# EasyEDA Pro project New Project ufcd 6024.eprj

# Schematic Schematic1
Board Name: Board1; Create Date: 2025-01-02; Page Name: P1; Project Name: New Project ufcd 6024; Schematic Name: Schematic1; Update Date: 2025-01-02; Company: EasyEDA.com; Page Size: A4; Version: V1.0
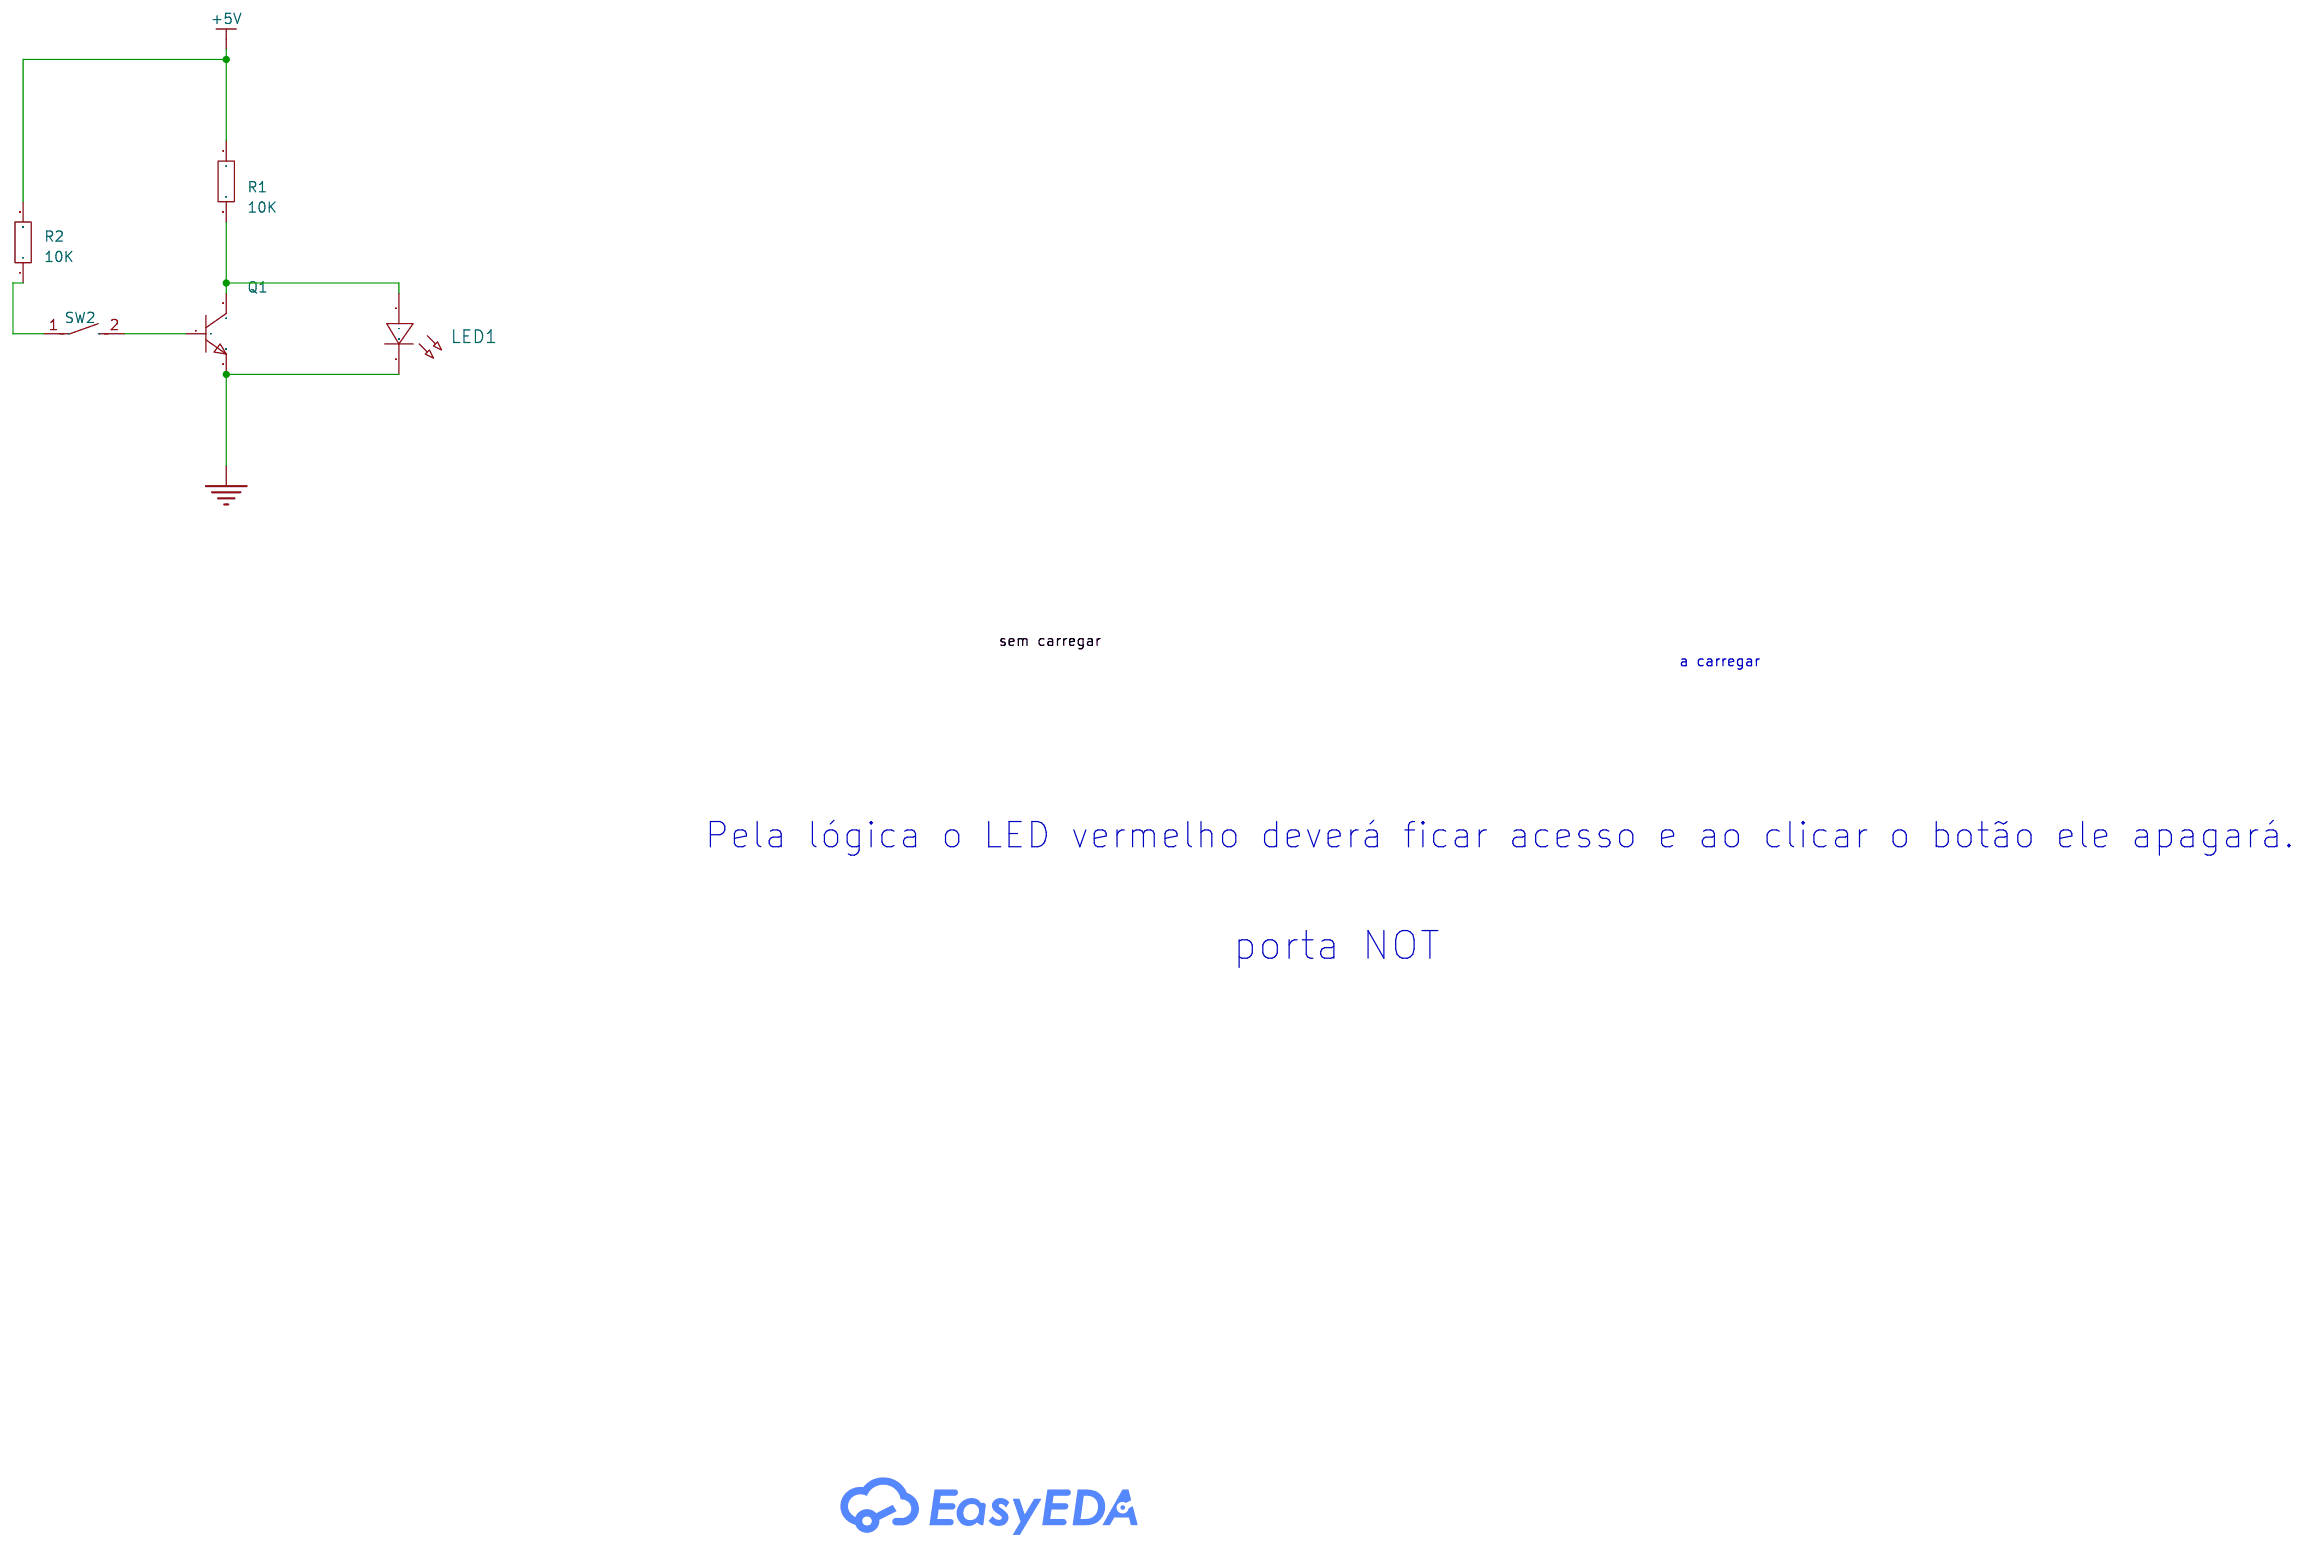
[diagram p0: schematic sheet]

## Parts
LED1  -  [LED_0603]
Q1  -  [S8050_SOT-23]
R1  10K  [R0603]
R2  10K  [R0603]
SW2  -  [SW-TH_DS-01RP]

## Library data of the parts
LED1 = LED_0603-R: Supplier Footprint: 0603
Q1 = S8050_SOT_NPN: Supplier Footprint: SOT-23
R1 R2 = Res_0603: Supplier Footprint: 0603
SW2 = DS-01RP: LCSC Part Name: 红色1PIN立式直插正拨拨码开关; Supplier Part: C129059; Manufacturer: 韩国韩荣; Supplier Footprint: 插件; JLCPCB Part Class: Extended Part; Datasheet: https://atta.szlcsc.com/upload/public/pdf/source/20191118/C129059_51F1ED47ECA198F739F369D83343E373.pdf; Supplier: LCSC; Type: 平拨，凸起式; Current Rating: 25mA; Voltage Rating: 24V; Circuit: SPST; Number of Positions: 1; Operating Temperature: -20℃~+70℃; Operating Life: 3000; Color: Red

## Nets
+5V: R1.1 R2.2
GND: LED1.1(C) Q1.2
Net-(LED1-2): LED1.2(A) Q1.3 R1.2
Net-(Q1-1): Q1.1 SW2.2
Net-(R2-1): R2.1 SW2.1

## Notes on the sheet
- sem carregar
- a carregar
- Pela lógica o LED vermelho deverá ficar acesso e ao clicar o botão ele apagará.
- porta NOT
